# EAGLE schematic GWLSensorv6 (EAGLE 9.5.2)
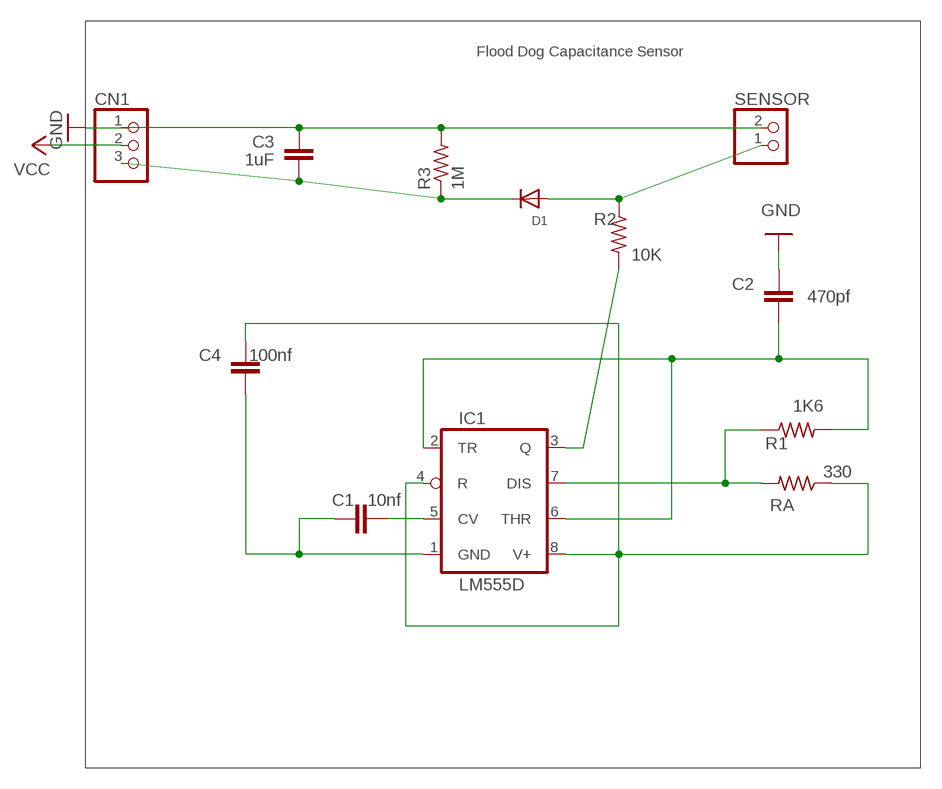
[diagram p0: schematic, sheet 1]

## Parts
C1  10nf  C-EUC0805  [C0805]
C2  470pf  C-EUC0805  [C0805]
C3  1uF  C-EUC0805  [C0805]
C4  100nf  C-EUC0805  [C0805]
CN1  JST_3PIN  [JSTPH3]
D1  DIODESMA  [SMADIODE]
IC1  LM555D  [SO08]
R1  1K6  R-US_R0805  [R0805]
R2  10K  R-US_R0805  [R0805]
R3  1M  R-US_R0805  [R0805]
RA  330  R-US_R0805  [R0805]
SENSOR  JST_2PIN-SMT  [JST-PH-2-SMT]

## Nets
GND: C2.2 C3.2 CN1.1 R3.2 SENSOR.2
N$1: C3.1 CN1.3 D1.C R3.1
N$2: IC1.7(DIS) R1.1 RA.2
N$3: C2.1 IC1.2(TR) IC1.6(THR) R1.2
N$4: C1.2 IC1.5(CV)
N$5: C4.2 IC1.4(R) IC1.8(V+) RA.1
N$6: D1.A R2.1 SENSOR.1
N$7: IC1.3(Q) R2.2
N$8: C1.1 C4.1 IC1.1(GND)
VCC: CN1.2

## Notes on the sheet
- Flood Dog Capacitance Sensor

## Library data of the parts
C1-C4 = rcl:C-EU: CAPACITOR, European symbol
CN1 = adafruit:JST_3PIN
D1 = adafruit:DIODE: Diode SMADIODE - SMA Surface Mount Package 20V 1A Schottky Diode Digikey: 641-1014-6-ND DO-1N4148 - Through Hole Small Current Diode SOD-123 20V 1 A (.5mV Vf) Schottky Diode - Digikey: MBRX120TPMSCT-ND SOD-323 10V 570mA (.38mV Vf, 3ns) Schottky Diode - Digikey: ZLLS410CT-ND SOD-523 30V 30mA Schottky Diode (RB751S-40TE61) - Digikey: RB751S-40TE61CT-ND SOT23-R/W - SOT23 Package (R = Solder Paste/Reflow Ovens, W = Hand-Soldering) BAT54Film 40V 300mA - Digikey: 497-7162-1-ND
IC1 = linear:*555: TIMER
R1-R3 RA = rcl:R-US_: RESISTOR, American symbol
SENSOR = adafruit:JST_2PIN: JST 2-Pin Connectors of various flavors SMT-RA (S2B-PH-SM4) 4UConnector #17311 SMT (B2B-PH-SM4) THM-RA (S2B-PH) THM (B2B-PH)